# EAGLE design Precharge_M2019_V1.1 (EAGLE 9.2.2)
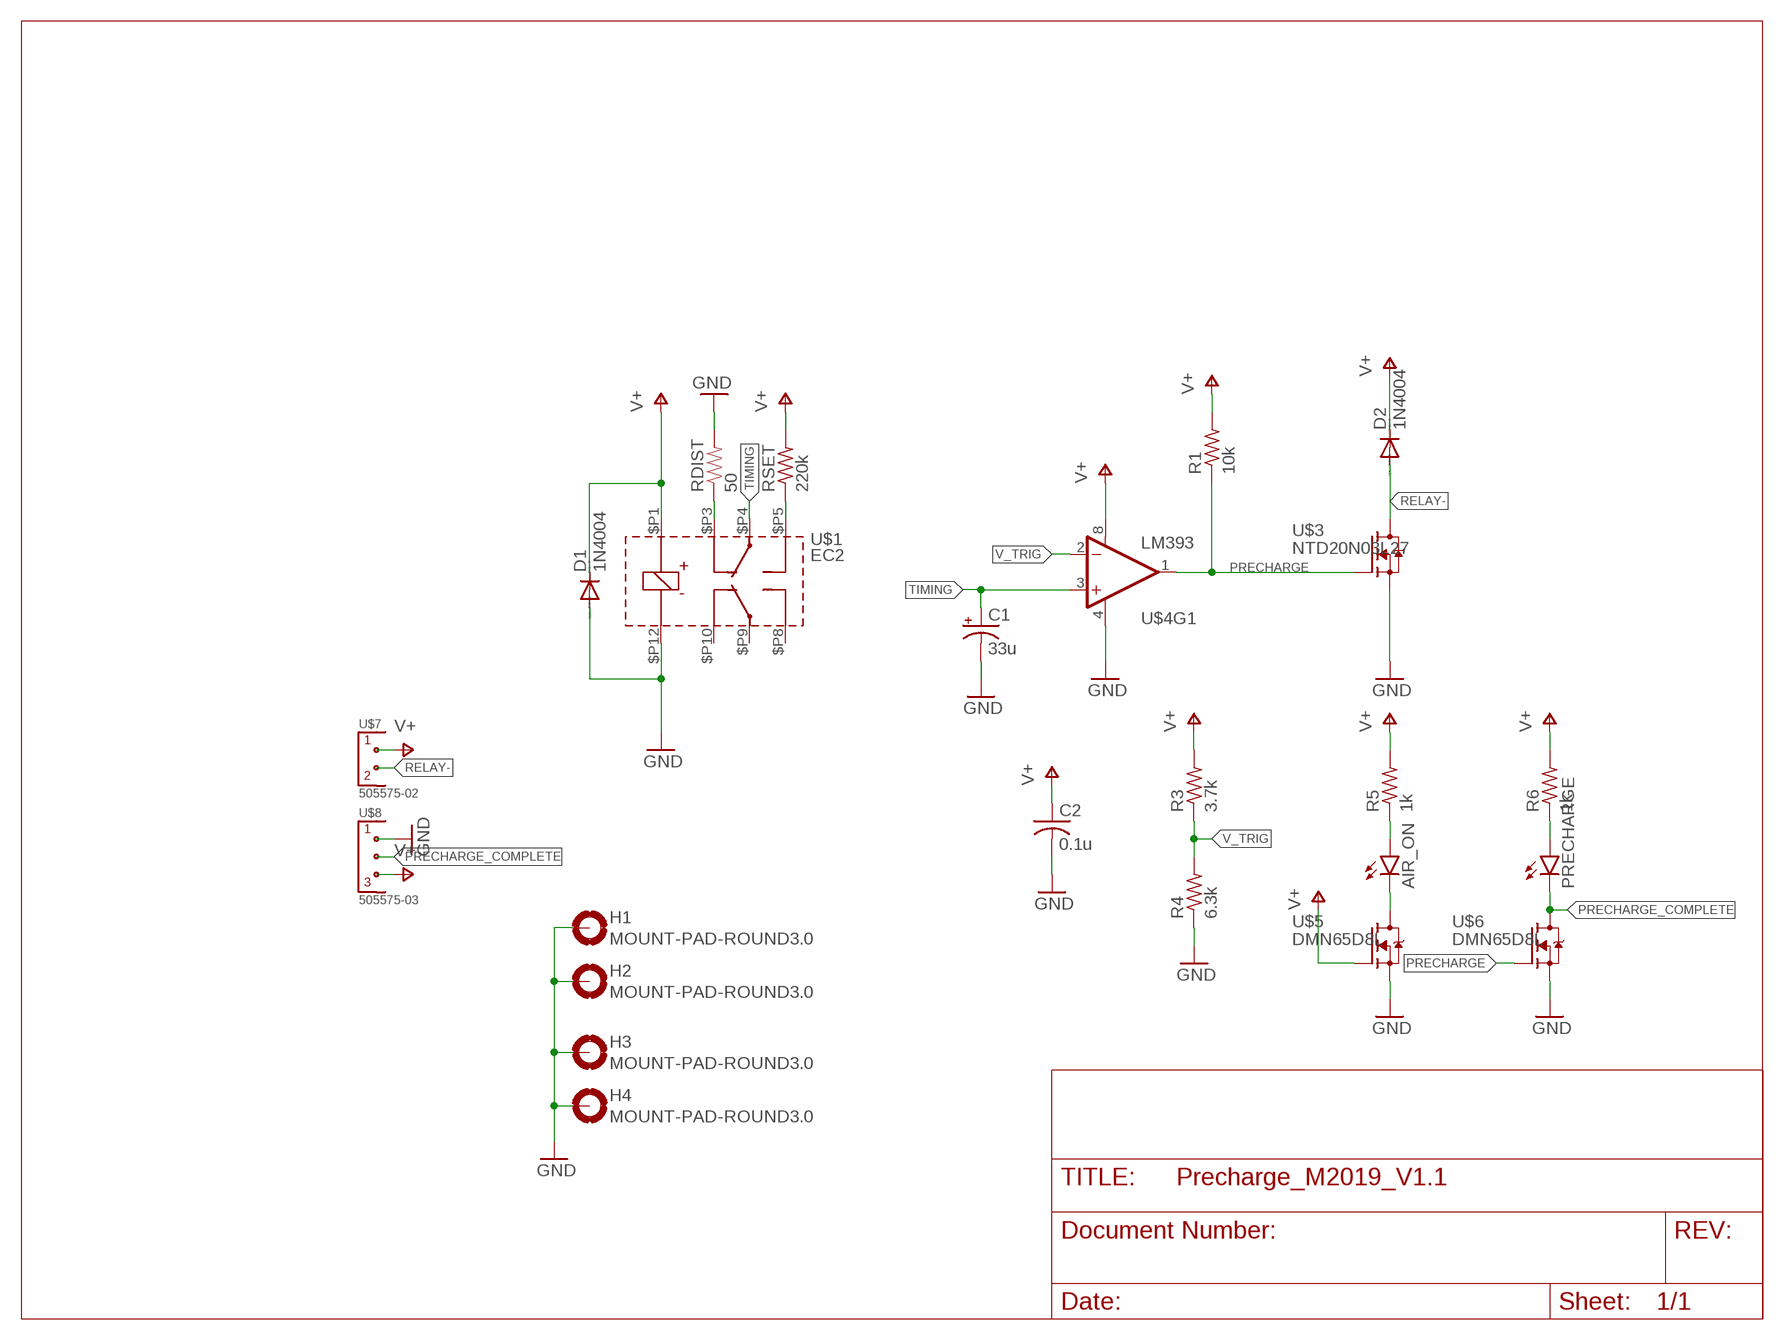
[diagram p0: schematic, sheet 1]

## Parts
AIR_ON  LED0603  [LED-0603]
C1  33u  CPOL-USE2.5-5  [E2,5-5]
C2  0.1u  C-USC0805  [C0805]
D1  1N4004  [DO41-10]
D2  1N4004  [DO41-10]
H1  MOUNT-PAD-ROUND3.0  [3,0-PAD]
H2  MOUNT-PAD-ROUND3.0  [3,0-PAD]
H3  MOUNT-PAD-ROUND3.0  [3,0-PAD]
H4  MOUNT-PAD-ROUND3.0  [3,0-PAD]
PRECHARGE  LED0603  [LED-0603]
R1  10k  R-US_R0805  [R0805]
R3  3.7k  R-US_R0805  [R0805]
R4  6.3k  R-US_R0805  [R0805]
R5  1k  R-US_R0805  [R0805]
R6  1k  R-US_R0805  [R0805]
RDIST  50  RESISTORPTH-1/2W  [AXIAL-0.5]
RSET  220k  R-US_0207/10  [0207/10]
U$1  EC2  [DPDT_2.54]
U$3  NTD20N03L27  [DPACK]
U$4  LM393  [SO08]
U$5  DMN65D8L  [SOT23]
U$6  DMN65D8L  [SOT23]
U$7  505575-02  [505575-02]
U$8  505575-03  [505575-03]

## Nets
GND: C1.- C2.2 D1.A H1.B3,0(MOUNT) H2.B3,0(MOUNT) H3.B3,0(MOUNT) H4.B3,0(MOUNT) R4.1 RDIST.P$2 U$1.$P12 U$3.3(S) U$4.4(V-) U$5.2(S) U$6.2(S) U$8.1
N$1: RSET.1 U$1.$P5
N$3: RDIST.P$1 U$1.$P3
N$5: AIR_ON.A R5.1
N$6: PRECHARGE.A R6.1
N$9: AIR_ON.C U$5.3(D)
PRECHARGE: R1.1 U$3.1(G) U$4.1(OUT) U$6.1(G)
PRECHARGE_COMPLETE: PRECHARGE.C U$6.3(D) U$8.2
RELAY-: D2.A U$3.2(D) U$7.2
TIMING: C1.+ U$1.$P4 U$4.3(+IN)
V+: C2.1 D1.C D2.C R1.2 R3.2 R5.2 R6.2 RSET.2 U$1.$P1 U$4.8(V+) U$5.1(G) U$7.1 U$8.3
V_TRIG: R3.1 R4.2 U$4.2(-IN)
Unconnected: U$1.$P8 U$1.$P9 U$1.$P10 U$4.5(+IN) U$4.6(-IN) U$4.7(OUT)

## Library data of the parts
AIR_ON PRECHARGE = SparkFun-LED:LED: LEDs Standard schematic elements and footprints for 5mm, 3mm, 1206, and 0603 sized LEDs. 5mm - Spark Fun Electronics SKU : COM-00529 (and others)
C1 = rcl:CPOL-US: POLARIZED CAPACITOR, American symbol; SPICEPREFIX: C
C2 = resistor:C-US: CAPACITOR, American symbol
D1 D2 = Diodes_IFE:1N4004: DIODE general purpose rectifier, 1 A
H1-H4 = holes:MOUNT-PAD-ROUND: MOUNTING PAD, round
R1 R3-R6 RSET = rcl:R-US_: RESISTOR, American symbol; SPICEPREFIX: R
RDIST = SparkFun-Resistors:RESISTOR: Resistor Basic schematic elements and footprints for 0603, 1206, and PTH resistors.
U$1 = KEMET:EC2: KEMET EC2 DPDT General Purpose 2A Relay. 12V coil voltage. Datasheet <https://content.kemet.com/datasheets/KEM_R7002_EC2_EE2.pdf> Digikey <https://www.digikey.com/product-detail/en/kemet/EC2-12TNU/399-11031-5-ND/4291097>
U$3 = Display_Custom:NTD20N03L27: ON-Semi 30V 20A Mosfet https://media.digikey.com/pdf/Data%20Sheets/ON%20Semiconductor%20PDFs/NTD20N03L27,NVD20N03L27.pdf
U$4 = SparkFun-AnalogIC:LM393: Low-voltage comparator
U$5 U$6 = Display_Custom:DMN65D8L: 60V N-Channel Mosfet SOT23 https://www.diodes.com/assets/Datasheets/DMN65D8L.pdf
U$7 = MOLEX:505575-02: Molex 505575-02 2 Position 2.00mm pitch connector wire to board connector Datasheet <https://www.molex.com/pdm_docs/sd/5055750271_sd.pdf>
U$8 = MOLEX:505575-03: Molex 505575-03 3 Position 2.00mm pitch connector wire to board connector Datasheet <https://www.molex.com/pdm_docs/sd/5055750271_sd.pdf>

## Board
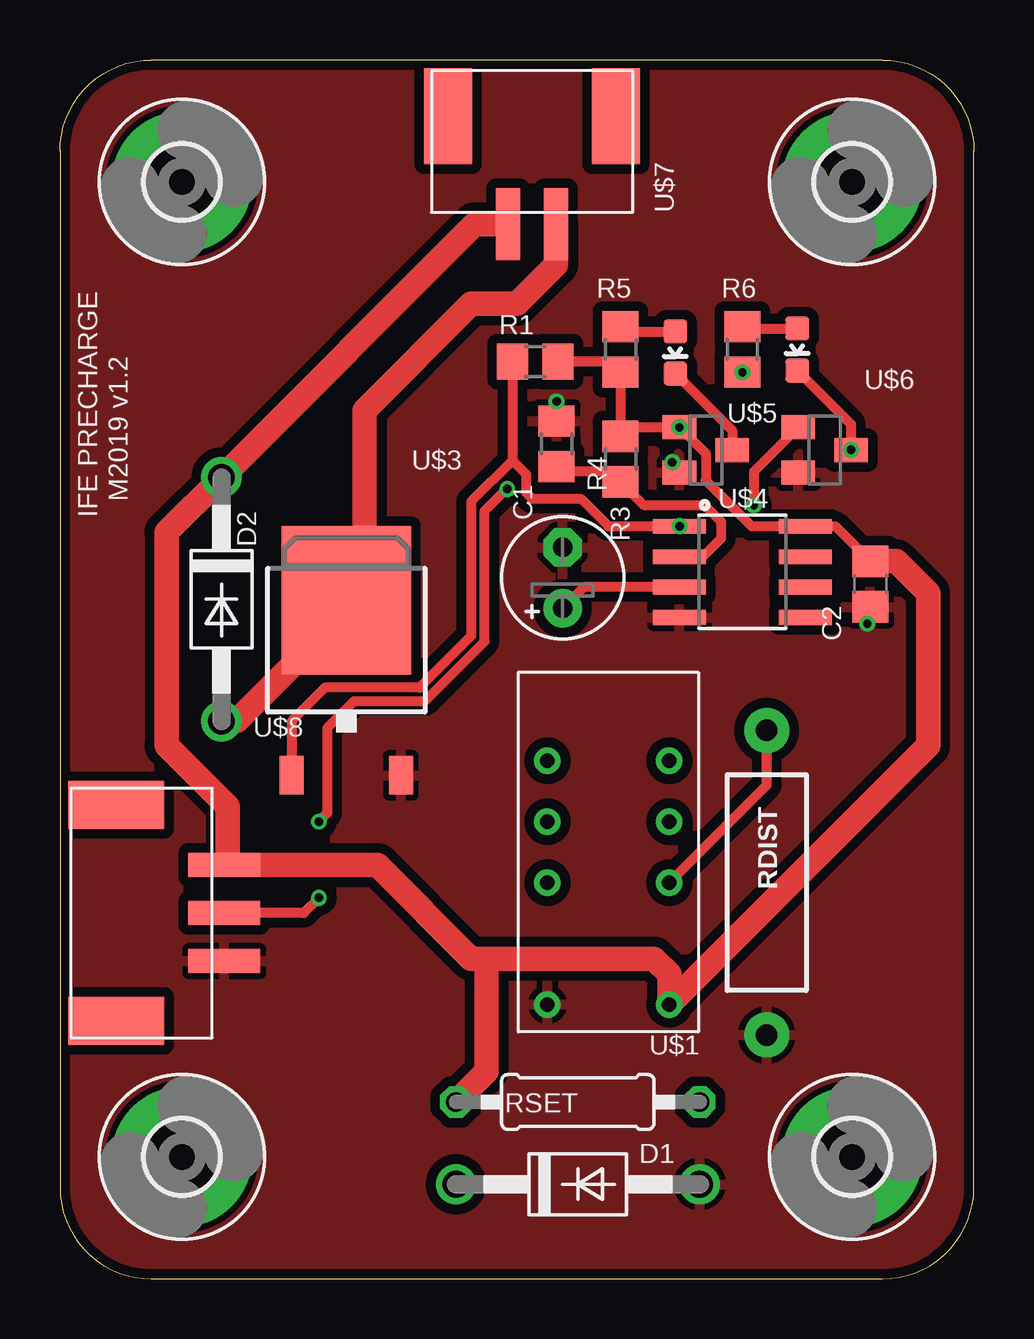
[diagram p1: board, top side]
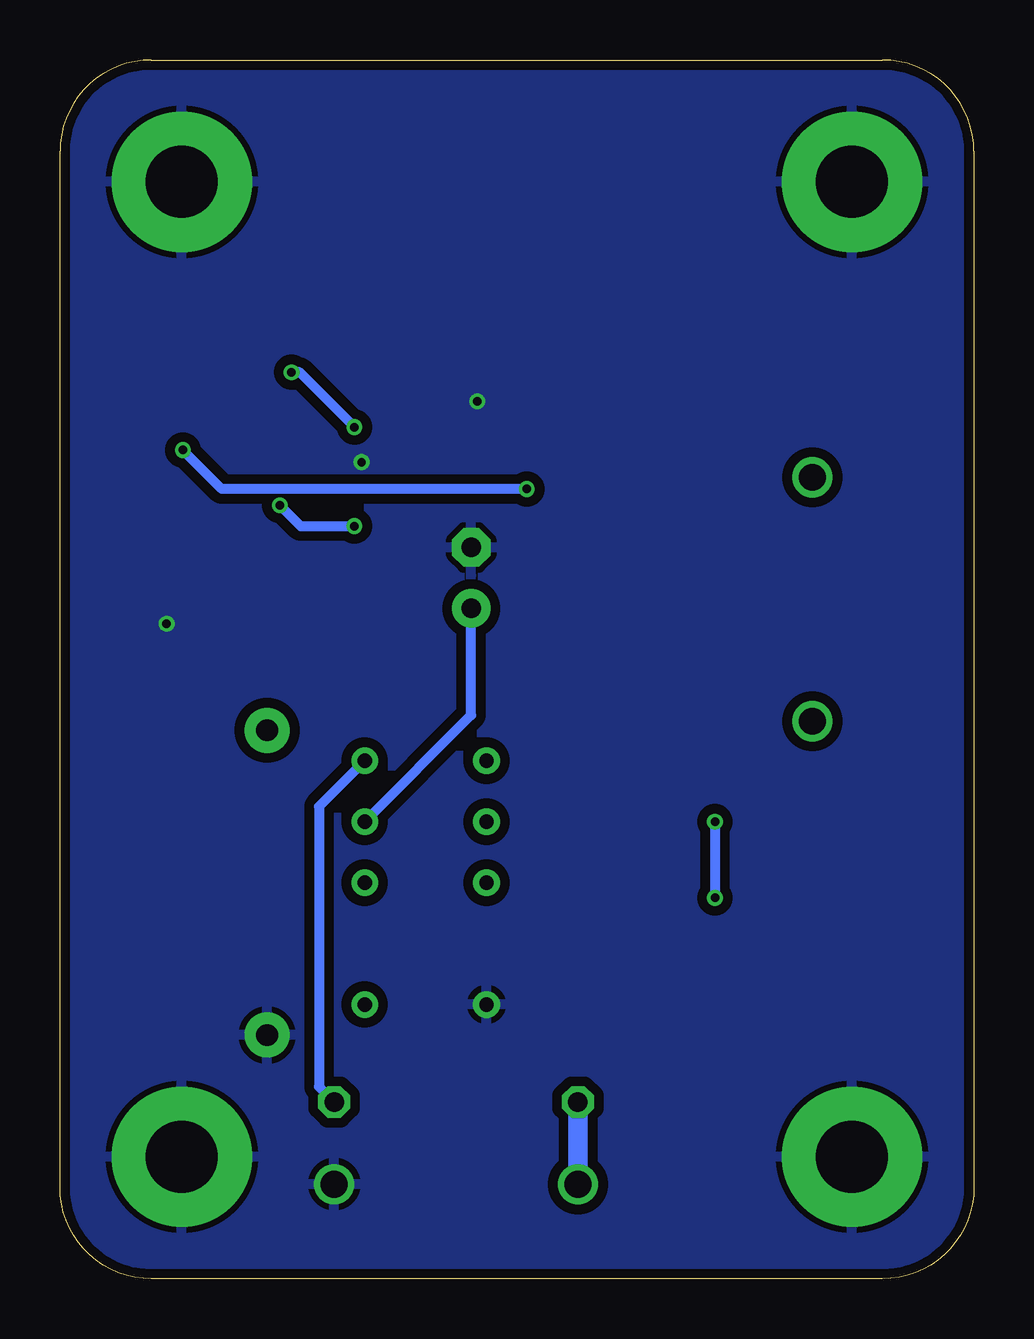
[diagram p2: board, bottom side, seen from below]

Size 38.1 x 50.8 mm. Coordinates in mm from the lower left corner, seen from the top.
Outline: 3.81,0 34.29,0 arc90 38.1,3.81 38.1,46.99 arc90 34.29,50.8 3.81,50.8 arc90 0,46.99 0,3.81 arc90 3.81,0
Copper layers (1*16): Top 0.035mm / dielectric 1.5mm / Bottom 0.035mm
Design rules "SeeedStudio_2layer_DRU_no_angle_20140221": minimum track width 6mil, minimum drill 12mil, track to track 6mil, track to pad 6mil, pad to pad 6mil, via to via 6mil, smd to smd 0mil, copper to edge 10mil, drill to drill 10mil, minimum pad ring 10mil, minimum via ring 6mil, stop-mask expansion 2mil, vias tented up to drill 100mil, thermal gap 10mil

### Footprints (pad centres in the part's own frame; a part is rotated, then mirrored left to right if it is on the bottom)
LED-0603 = smd 1 x 1: A 0,-0.877; C 0,0.877
E2,5-5 = drill 0.813 pad 1.6: + -1.27,0 | drill 0.813 pad 1.6 octagon: - 1.27,0
C0805 = smd 1.3 x 1.5: 1 -0.95,0; 2 0.95,0
DO41-10 = drill 1.118: A 5.08,0; C -5.08,0
3,0-PAD = drill 3 pad 5.842: B3,0 0,0
R0805 = smd 1.3 x 1.5: 1 -0.95,0; 2 0.95,0
AXIAL-0.5 = drill 0.9 pad 1.88: P$1 -6.35,0; P$2 6.35,0
0207/10 = drill 0.813 octagon: 1 -5.08,0; 2 5.08,0
DPDT_2.54 = drill 0.6: $P1 -6.35,-2.54; $P3 -1.27,-2.54; $P4 1.27,-2.54; $P5 3.81,-2.54; $P8 3.81,2.54; $P9 1.27,2.54; $P10 -1.27,2.54; $P12 -6.35,2.54
DPACK = smd 1 x 1.6: 1 -2.28,-4.8; 3 2.28,-4.8 | smd 5.4 x 6.2: 2 0,2.5
SO08 = smd 0.61 x 2.21: 1 -1.905,-2.616; 2 -0.635,-2.616; 3 0.635,-2.616; 4 1.905,-2.616; 5 1.905,2.616; 6 0.635,2.616; 7 -0.635,2.616; 8 -1.905,2.616
SOT23 = smd 1 x 1.4: 1 -0.95,-1.1; 2 0.95,-1.1; 3 0,1.1
505575-02 = smd 1 x 3: 1 -1,-0.5; 2 1,-0.5 | smd 2 x 4: P$3 -3.5,4; P$4 3.5,4
505575-03 = smd 1 x 3: 1 -2,-0.5; 2 0,-0.5; 3 2,-0.5 | smd 2 x 4: P$3 -4.5,4; P$4 4.5,4

### Placement (x,y rotation side)
AIR_ON  25.65,38.61 180 top
C1  20.95,29.21 90 top
C2  33.78,28.96 270 top
D1  21.59,3.94 0 top
D2  6.73,28.32 270 top
H1  5.08,5.08 0 top
H2  33.02,5.08 0 top
H3  33.02,45.72 0 top
H4  5.08,45.72 0 top
PRECHARGE  30.73,38.73 180 top
R1  19.81,38.23 0 top
R3  23.37,34.16 90 top
R4  20.7,34.8 270 top
R5  23.37,38.73 270 top
R6  28.45,38.73 270 top
RDIST  29.46,16.51 270 top
RSET  21.59,7.37 180 top
U$1  22.86,17.78 90 top
U$3  11.94,25.78 0 top
U$4  28.45,29.46 270 top
U$5  26.92,34.54 270 top
U$6  31.88,34.54 270 top
U$7  19.68,44.45 0 top
U$8  6.35,15.24 90 top

### Tracks (layer width: path | path; a pad name or v marks a point on that pad's centre or on a via)
GND  (via drill 0.35)
  Top 0.406: v33.66,27.3 33.78,27.43 C2.2
  other vias: 20.7,36.58 25.53,34.04
  pour Top (isolate 0.406): 0,50.8 0,0 38.1,0 38.1,50.8
  pour Bottom (isolate 0.406): 0,50.8 0,0 38.1,0 38.1,50.8
N$1
  Bottom 0.406: U$1.$P5 27.3,19.68 27.3,8 RSET.1
N$3
  Top 0.406: U$1.$P3 29.46,20.57 RDIST.P$1
N$5
  Top 0.406: R5.1 23.57,39.48 AIR_ON.A
N$6
  Top 0.406: R6.1 28.52,39.61 PRECHARGE.A
N$9
  Top 0.406: AIR_ON.C 28.02,35.36 U$5.3
PRECHARGE  (via drill 0.35)
  Top 0.406: R1.1 18.86,34.1 | 18.86,34.1 17.14,32.38 17.14,26.8 14.99,24.64 11.05,24.64 9.66,23.25 U$3.1 | 18.86,34.1 19.43,33.53 19.43,32.77 19.68,32.51 21.72,32.51 22.86,31.37 U$4.1 | U$6.1 28.93,33.65 v28.93,32.23
  Bottom 0.406: v28.93,32.23 28.06,31.37 U$4.1
  other vias: 25.83,31.37
PRECHARGE_COMPLETE  (via drill 0.35)
  Top 0.406: PRECHARGE.C 32.98,35.62 U$6.3 | v18.64,32.92 18.62,32.92 17.7,32 17.7,26.57 15.22,24.08 12.27,24.08 11.14,22.95 11.14,19.39 v10.79,19.05 | v10.79,15.88 10.16,15.24 U$8.2
  Bottom 0.406: v18.64,32.92 31.35,32.92 U$6.3 | v10.79,19.05 v10.79,15.88
  other vias: 32.98,34.54
RELAY-
  Top 1.016: U$7.2 20.68,42.27 19.05,40.64 17.14,40.64 12.7,36.2 12.7,28.57 | 12.7,28.57 7.37,23.24 D2.A | U$3.2 12.23,28.57 12.7,28.57
TIMING
  Top 0.406: U$4.3 21.84,28.83 C1.+
  Bottom 0.406: U$1.$P4 20.95,23.5 C1.+
V+  (via drill 0.35)
  Top 0.406: C2.1 32.32,31.37 U$4.8 28.83,31.37 26.92,33.27 26.92,34.39 U$5.1 23.75,35.49 R3.2 R5.2 22.93,38.23 R1.2
  Top 1.016: 17.78,13.34 24.77,13.34 25.4,12.7 U$1.$P1 36.2,22.23 36.2,28.57 34.86,29.91 C2.1 | 17.78,13.34 17.14,13.34 13.24,17.24 U$8.3 6.99,17.38 6.99,19.68 4.45,22.23 4.45,31.11 D2.C 17.28,43.95 U$7.1 | 17.78,13.34 17.78,8.64 RSET.2
  Bottom 0.406: U$5.1 28.11,37.78 R6.2
  Bottom 0.813: RSET.2 D1.C
  other vias: 25.82,35.49 28.45,37.78
V_TRIG
  Top 0.406: R4.2 20.89,33.66 22.93,33.66 R3.1 24.32,32.26 26.86,32.26 27.56,31.55 27.56,30.86 26.8,30.1 U$4.2

### Text on the board
tNames: IFE PRECHARGE | M2019 v1.2